# Altium schematic sheet Sheet1.SchDoc
size A4
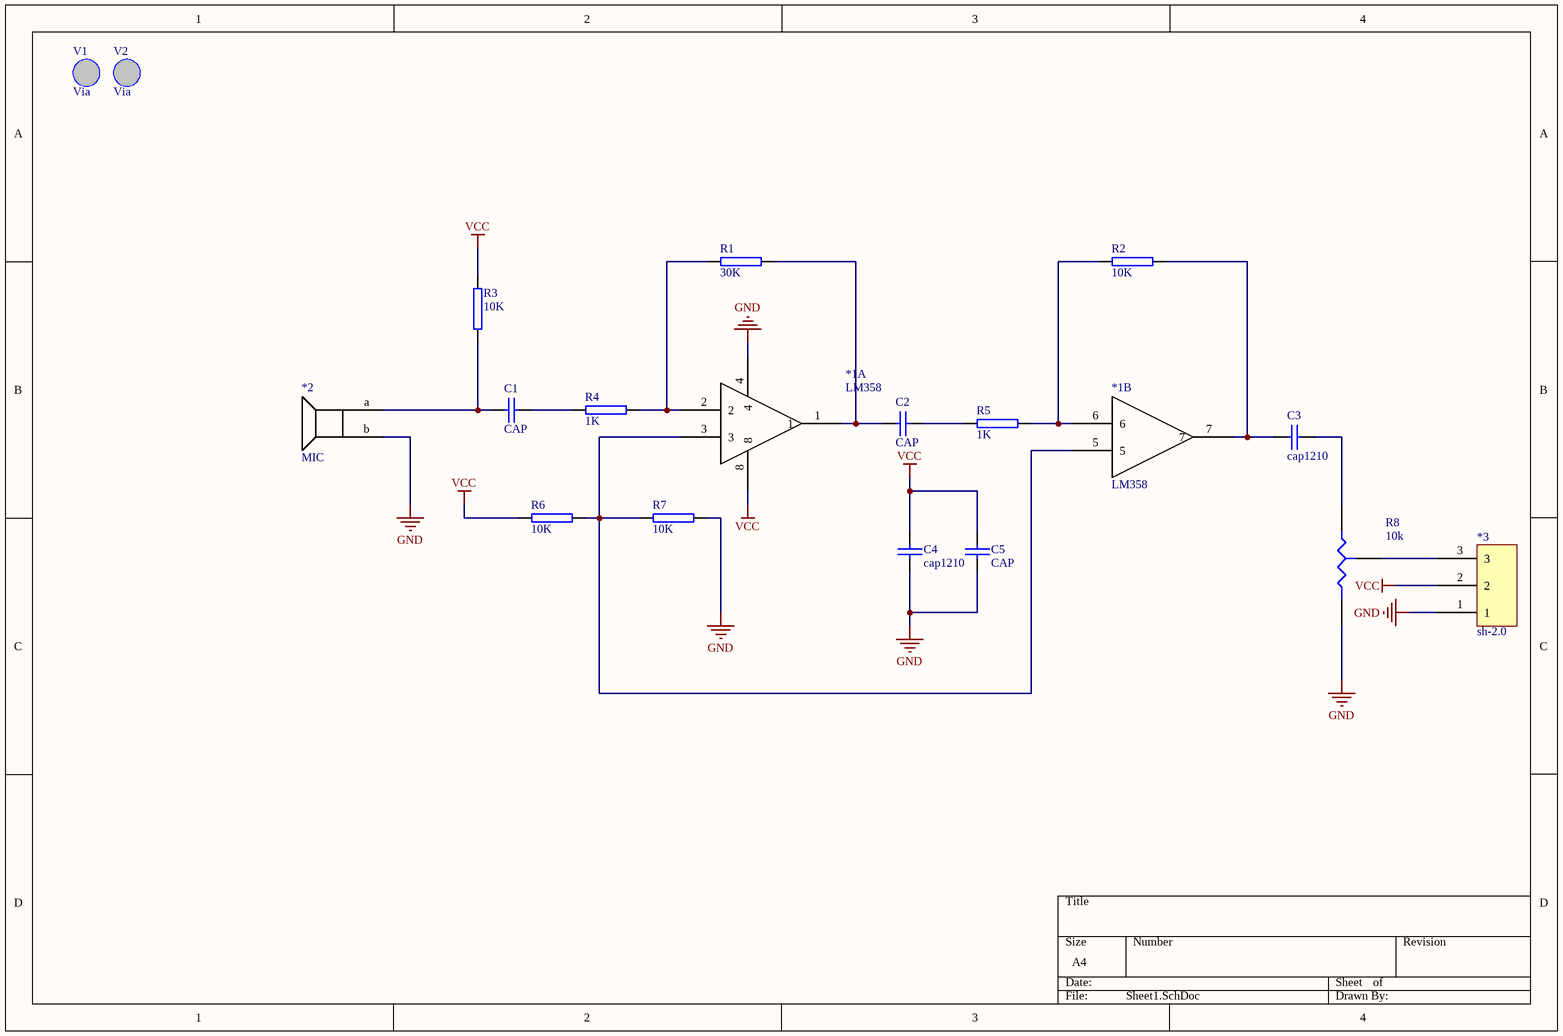
[diagram p0: Sheet1.SchDoc]

## Parts
*1  LM358  [HMC_S8]  (parts A,B of 2)
*2  MIC
*3  sh-2.0  [sh-2.0]
C1  CAP  [1608[0603]]
C2  CAP  [1608[0603]]
C3  cap1210  [C1210]
C4  cap1210  [C1210]
C5  CAP  [0402]
R1  30K  [1608[0603]]
R2  10K  [1608[0603]]
R3  10K  [1608[0603]]
R4  1K  [1608[0603]]
R5  1K  [1608[0603]]
R6  10K  [1608[0603]]
R7  10K  [1608[0603]]
R8  10k  [BORUNS_3314J-1]
V1  Via  [Via]
V2  Via  [Via]

## Nets
GND: *1.4 *3.1 C4.2 C5.1 R7.2 R8.2(B)
VCC: *1.8 *3.2 C4.1 C5.2 R3.2 R6.1
Net*1_1: *1.1 C2.1 R1.2
Net*1_2: *1.2 R1.1 R4.2
Net*1_3: *1.3 *1.5 R6.2 R7.1
Net*1_6: *1.6 R2.1 R5.2
Net*1_7: *1.7 C3.1 R2.2
Net*3_3: *3.3 R8.3(TAP)
NetC1_1: C1.1 R3.1
NetC1_2: C1.2 R4.1
NetC2_2: C2.2 R5.1
NetC3_2: C3.2 R8.1(A)

Not connected (* = marked no-connect by the designer): *2 a(1) b(2)

## Library data of the parts
*3 = sh-2.0: pin to pad: 1>3 3>1
C3 C4 = cap0603
R1-R7 = RES
R8 = Res Tap